# EAGLE design T02_noclock_rev1 (EAGLE 7.1.0)
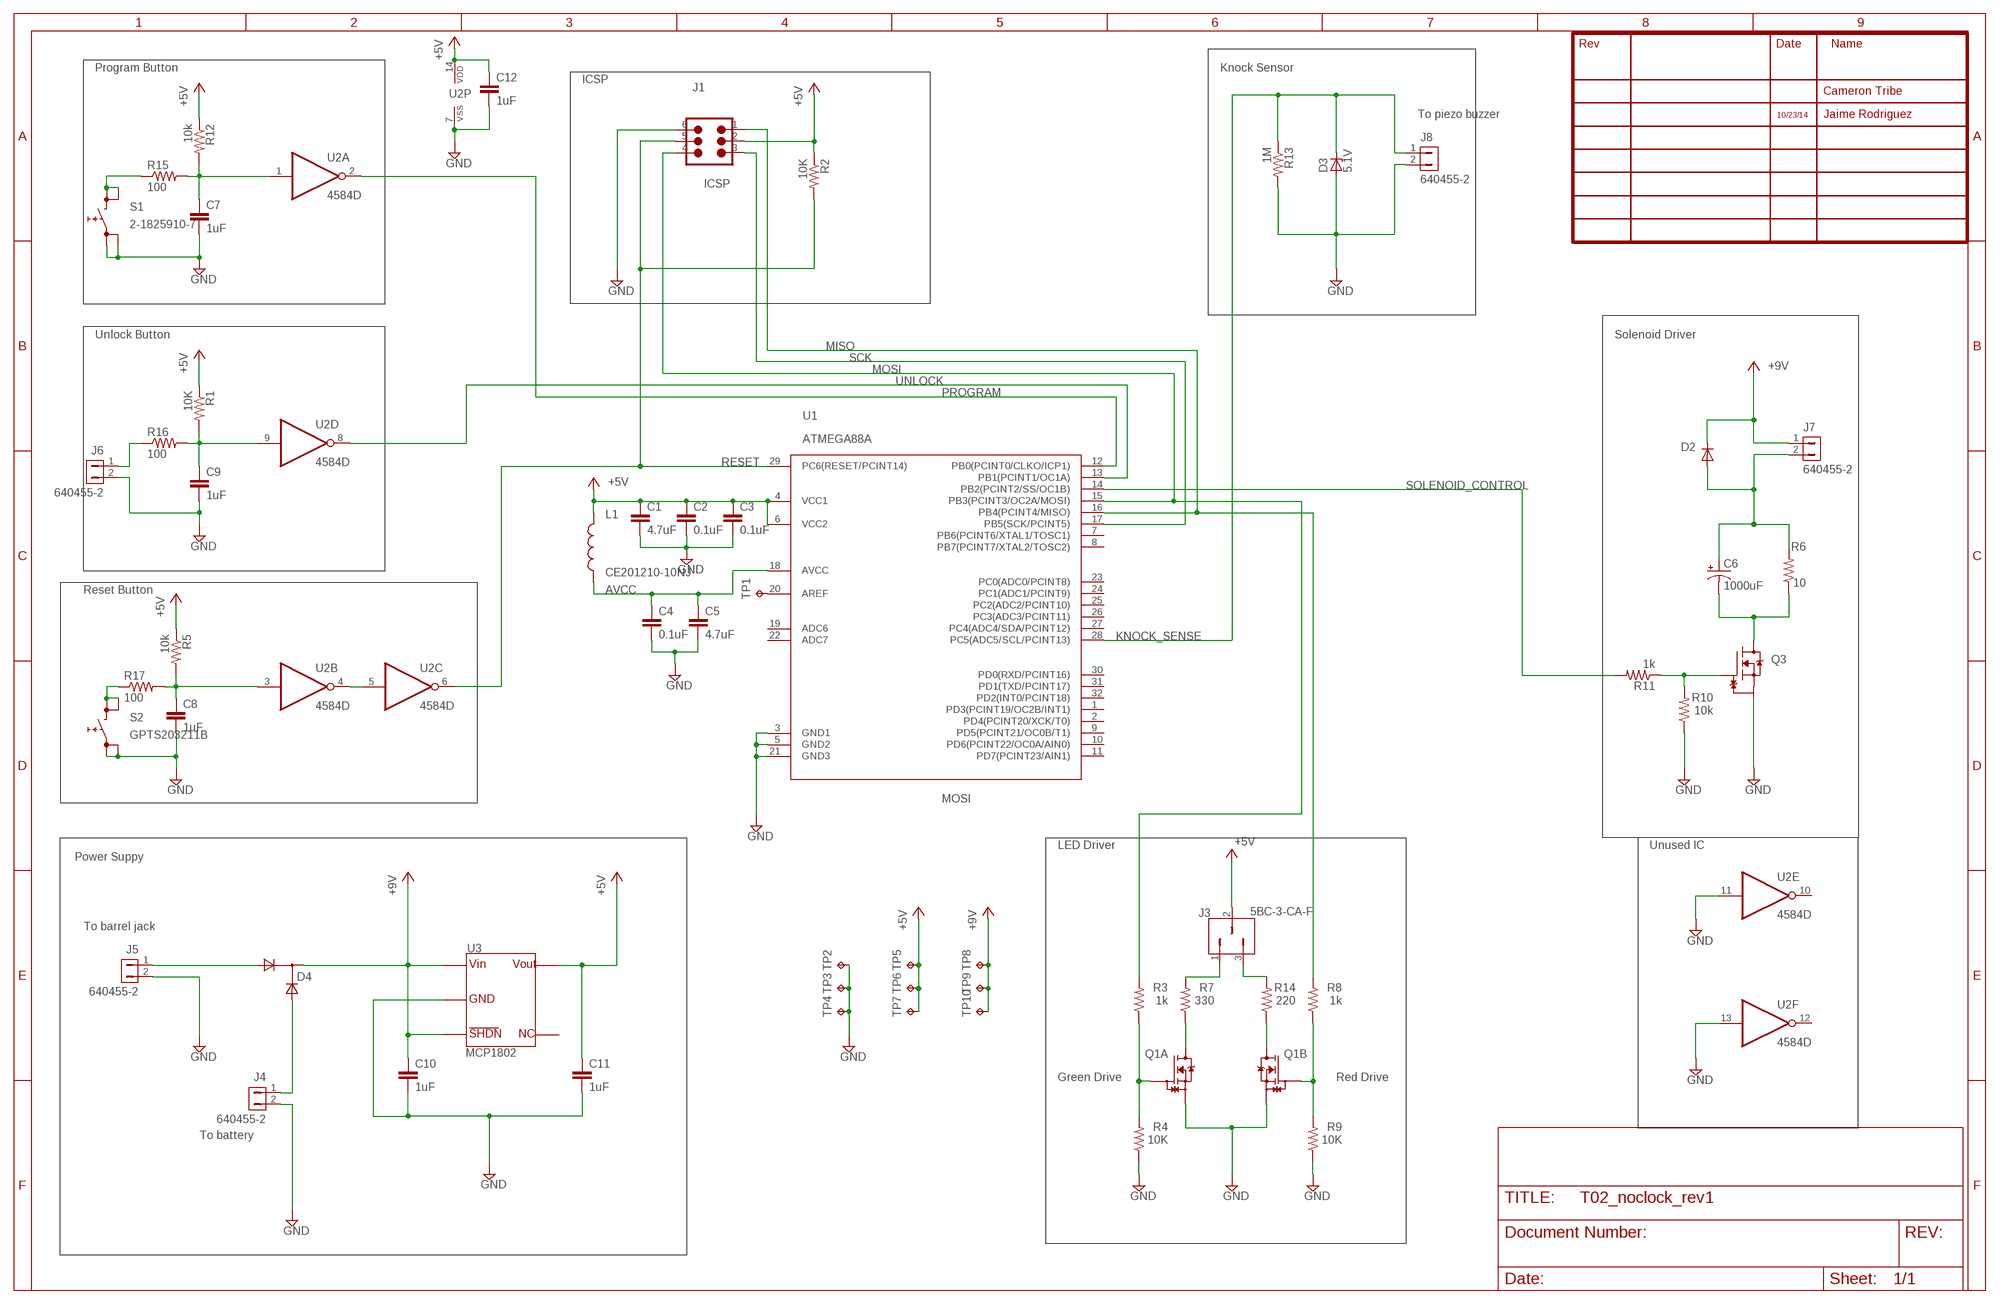
[diagram p0: schematic, sheet 1]

## Parts
C1  4.7uF  C-EUC0805  [C0805]
C2  0.1uF  C-EUC0805  [C0805]
C3  0.1uF  C-EUC0805  [C0805]
C4  0.1uF  C-EUC0805  [C0805]
C5  4.7uF  C-EUC0805  [C0805]
C6  1000uF  EKY-100ELL102MH20D  [EKY-100ELL102MH20D]
C7  1uF  C-EUC0805  [C0805]
C8  1uF  C-EUC0805  [C0805]
C9  1uF  C-EUC0805  [C0805]
C10  1uF  C-EUC0805  [C0805]
C11  1uF  C-EUC0805  [C0805]
C12  1uF  C-EUC0805  [C0805]
D2  GF1  [SMA-DO214AC]
D3  5.1V  ZENER-DIODESOT23  [SOT23]
D4  PMEG2005CT,215  [SOT-23]
J1  ICSP  [ICSP]
J3  5BC-3-CA-F  [3_PIN_CONNECTOR]
J4  640455-2  [2-PIN_CONNECTOR]
J5  640455-2  [2-PIN_CONNECTOR]
J6  640455-2  [2-PIN_CONNECTOR]
J7  640455-2  [2-PIN_CONNECTOR]
J8  640455-2  [2-PIN_CONNECTOR]
L1  CE201210-10NJ  [R0805]
Q1  DMN63D8LDW-7  [SOT363]
Q3  DMG1012UW-7  [SOT323]
R1  10K  R-US_R0805  [R0805]
R2  10K  R-US_R0805  [R0805]
R3  1k  R-US_R0805  [R0805]
R4  10K  R-US_R0805  [R0805]
R5  10k  R-US_R0805  [R0805]
R6  10  R-US_R2512  [R2512]
R7  330  R-US_R0805  [R0805]
R8  1k  R-US_R0805  [R0805]
R9  10K  R-US_R0805  [R0805]
R10  10k  R-US_R0805  [R0805]
R11  1k  R-US_R0805  [R0805]
R12  10k  R-US_R0805  [R0805]
R13  1M  R-US_R0805  [R0805]
R14  220  R-US_R0805  [R0805]
R15  100  R-US_R0805  [R0805]
R16  100  R-US_R0805  [R0805]
R17  100  R-US_R0805  [R0805]
S1  2-1825910-7  [FSM14JH]
S2  GPTS203211B  [GPTS203211B]
TP1  TPTP19R  [TP19R]
TP2  TPTP19R  [TP19R]
TP3  TPTP19R  [TP19R]
TP4  TPTP19R  [TP19R]
TP5  TPTP19R  [TP19R]
TP6  TPTP19R  [TP19R]
TP7  TPTP19R  [TP19R]
TP8  TPTP19R  [TP19R]
TP9  TPTP19R  [TP19R]
TP10  TPTP19R  [TP19R]
U1  ATMEGA88A  [TQFP32]
U2  4584D  [SO14]
U3  MCP1802  [SOT23-5]

## Nets
9V: D4.3(A1) J5.1
+5V: C1.1 C2.1 C3.1 C11.1 C12.1 J1.2 J3.2 L1.2 R1.1 R2.1 R5.1 R12.1 TP5.TP TP6.TP TP7.TP U1.4(VCC1) U1.6(VCC2) U2.14(P:VDD) U3.5(VOUT)
+9V: C10.1 D2.K(C) D4.2(C) J7.1 TP8.TP TP9.TP TP10.TP U3.1(VIN) U3.3(SHDN)
AVCC: C4.1 C5.1 L1.1 U1.18(AVCC)
BATT: D4.1(A2) J4.1
GND: C1.2 C2.2 C3.2 C4.2 C5.2 C7.2 C8.2 C9.2 C10.2 C11.2 C12.2 D3.1(A) J1.6 J4.2 J5.2 J6.2 J8.2 Q1.S1(A:S) Q1.S2(B:S) Q3.3(S) R4.1 R9.1 R10.1 R13.2 S1.1 S1.2 S2.1 S2.2 TP2.TP TP3.TP TP4.TP U1.3(GND1) U1.5(GND2) U1.21(GND3) U2.7(P:VSS) U2.11(E:I) U2.13(F:I) U3.2(GND)
KNOCK_SENSE: D3.3(C) J8.1 R13.1 U1.28(PC5(ADC5/SCL/PCINT13))
MISO: J1.1 R8.2 U1.16(PB4(PCINT4/MISO))
MOSI: J1.4 R3.2 U1.15(PB3(PCINT3/OC2A/MOSI))
N$1: Q1.D1(A:D) R7.1
N$2: Q1.G2(B:G) R8.1 R9.2
N$3: C9.1 R1.2 R16.2 U2.9(D:I)
N$5: J3.1 R7.2
N$6: J3.3 R14.2
N$7: R15.1 S1.3 S1.4
N$8: Q1.D2(B:D) R14.1
N$9: Q3.2(G) R10.2 R11.1
N$10: C6.+ D2.A J7.2 R6.2
N$11: C6.- Q3.1(D) R6.1
N$12: U2.4(B:O) U2.5(C:I)
N$13: TP1.TP U1.20(AREF)
N$14: R17.1 S2.3 S2.4
N$16: C8.1 R5.2 R17.2 U2.3(B:I)
N$17: J6.1 R16.1
N$19: C7.1 R12.2 R15.2 U2.1(A:I)
N$21: Q1.G1(A:G) R3.1 R4.2
PROGRAM: U1.12(PB0(PCINT0/CLKO/ICP1)) U2.2(A:O)
RESET: J1.5 R2.2 U1.29(PC6(RESET/PCINT14)) U2.6(C:O)
SCK: J1.3 U1.17(PB5(SCK/PCINT5))
SOLENOID_CONTROL: R11.2 U1.14(PB2(PCINT2/SS/OC1B))
UNLOCK: U1.13(PB1(PCINT1/OC1A)) U2.8(D:O)
Unconnected: U1.1(PD3(PCINT19/OC2B/INT1)) U1.2(PD4(PCINT20/XCK/T0)) U1.7(PB6(PCINT6/XTAL1/TOSC1)) U1.8(PB7(PCINT7/XTAL2/TOSC2)) U1.9(PD5(PCINT21/OC0B/T1)) U1.10(PD6(PCINT22/OC0A/AIN0)) U1.11(PD7(PCINT23/AIN1)) U1.19(ADC6) U1.22(ADC7) U1.23(PC0(ADC0/PCINT8)) U1.24(PC1(ADC1/PCINT9)) U1.25(PC2(ADC2/PCINT10)) U1.26(PC3(ADC3/PCINT11)) U1.27(PC4(ADC4/SDA/PCINT12)) U1.30(PD0(RXD/PCINT16)) U1.31(PD1(TXD/PCINT17)) U1.32(PD2(INT0/PCINT18)) U2.10(E:O) U2.12(F:O) U3.4(NC)

## Notes on the sheet
- Program Button | Knock Sensor
- ICSP
- Cameron Tribe
- To piezo buzzer | 10/23/14 | Jaime Rodriguez
- Unlock Button | Solenoid Driver
- Reset Button
- LED Driver | Unused IC
- Power Suppy
- To barrel jack
- Green Drive | Red Drive
- To battery

## Library data of the parts
C1 C5 = rcl:C-EU: CAPACITOR, European symbol; PARTNUM: CL21A475KOFNNNE
C2-C4 = rcl:C-EU: CAPACITOR, European symbol; PARTNUM: GRM155R61A104KA01D
C6 = nocLock_temp:EKY-100ELL102MH20D: CAP ALUM 1000UF 10V 20% RADIAL
C7-C12 = rcl:C-EU: CAPACITOR, European symbol; PARTNUM: CL21B105KBFNNNE
D2 = diode:GF1: DIODE; PARTNUM: S1J
D3 = diode:ZENER-DIODE: Z-Diode; PARTNUM: BZX84C4V7-TP
D4 = nocLock_temp:PMEG2005CT,215; PARTNUM: PMEG2005CT,215
J1 = nocLock_temp:ICSP: Programming ICSP Header
J3 = nocLock_temp_Rev2:5BC-3-CA-F: Connector Recept, 3-Pin; PARTNUM: 5BC-3-CA-F
J4-J8 = nocLock_temp_Rev2:640455-2: 2 Pin Rectangular Connector; PARTNUM: 640455-2
L1 = nocLock_temp:CE201210-10NJ: FIXED IND 10NH 300MA 300 MOHM
Q1 = nocLock_temp_Rev2:DMN63D8LDW-7: Dual MOSFET 2N-CH 30V 220MA SOT363; PARTNUM: DMN63D8LDW-7
Q3 = nocLock_temp:DMG1012UW-7: MOSFET N-CH 20V 1A SOT323 (For Solenoid); PARTNUM: DMG1012UW-7
R1 R2 R4 R5 R9 R10 R12 R15-R17 = rcl:R-US_: RESISTOR, American symbol; PARTNUM: ESR10EZPJ103
R3 R8 R11 = rcl:R-US_: RESISTOR, American symbol; PARTNUM: MCR10ERTF1001
R6 = rcl:R-US_: RESISTOR, American symbol; PARTNUM: CRM2512-JW-100ELF
R7 = rcl:R-US_: RESISTOR, American symbol; PARTNUM: MCR10ERTF3300
R13 = rcl:R-US_: RESISTOR, American symbol; PARTNUM: RMCF0805JT1M00
R14 = rcl:R-US_: RESISTOR, American symbol; PARTNUM: RMCF0805FT220R
S1 = nocLock_temp:2-1825910-7: SWITCH TACTILE SPST-NO 0.05A 12V Outline 6.00mm x 6.00mm Height 13mm
S2 = nocLock_temp:GPTS203211B: SWITCH PUSHBUTTON SPST 1A 30V OutLine 12x12mm Height 9.1mm
TP1-TP10 = testpad:TP: Test pad
U1 = nocLock_temp:ATMEGA88A: ATMega88A 8-Bit Microcontroller 23 GPIO pins RISC Architecture Up to 20 MHz; PARTNUM: ATMEGA88A-AUR
U2 = 45xx:4584: Hex SCHMITT TRIGGER (74C14); PARTNUM: 4584D
U3 = nocLock_temp:MCP1802: 5V Voltage Regulator MCP1802 Input Voltage Range: 2.0- 10.0 V Output Voltage 5V Current Max: 300 mA 25 uA Quiescent Current; PARTNUM: MCP1802

## Board
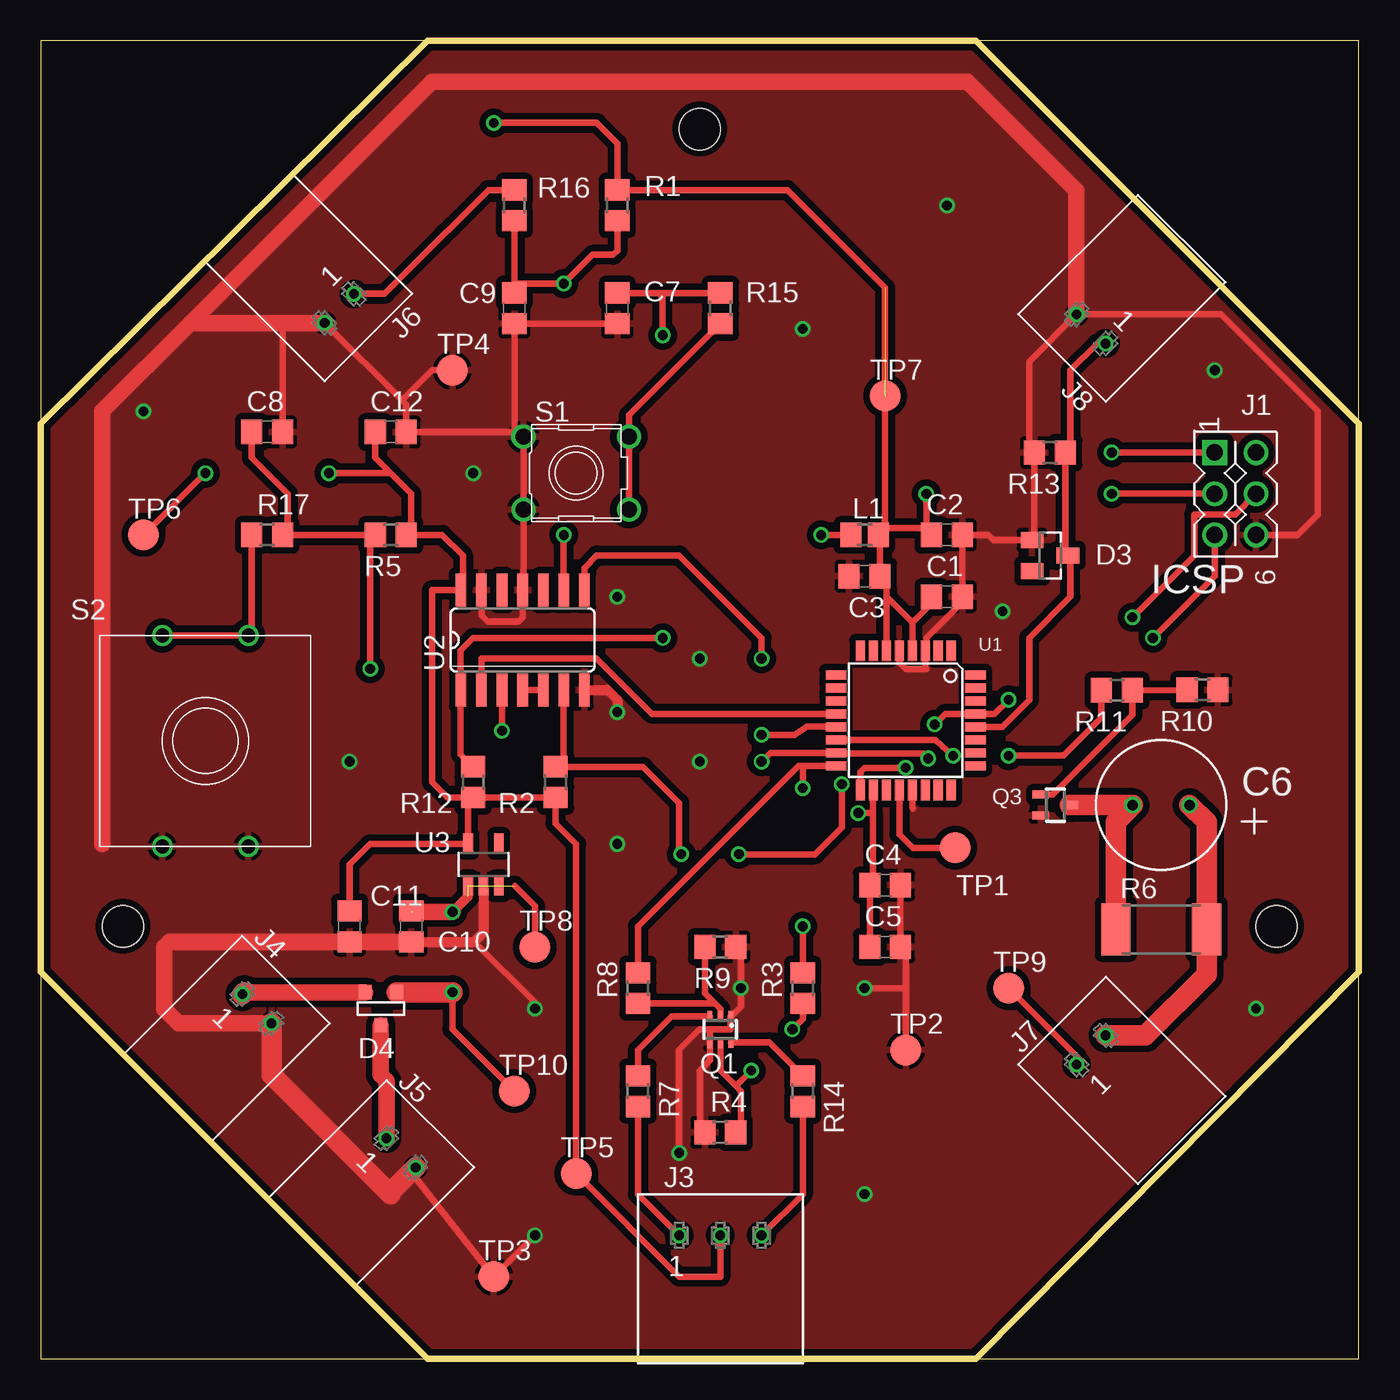
[diagram p1: board, top side]
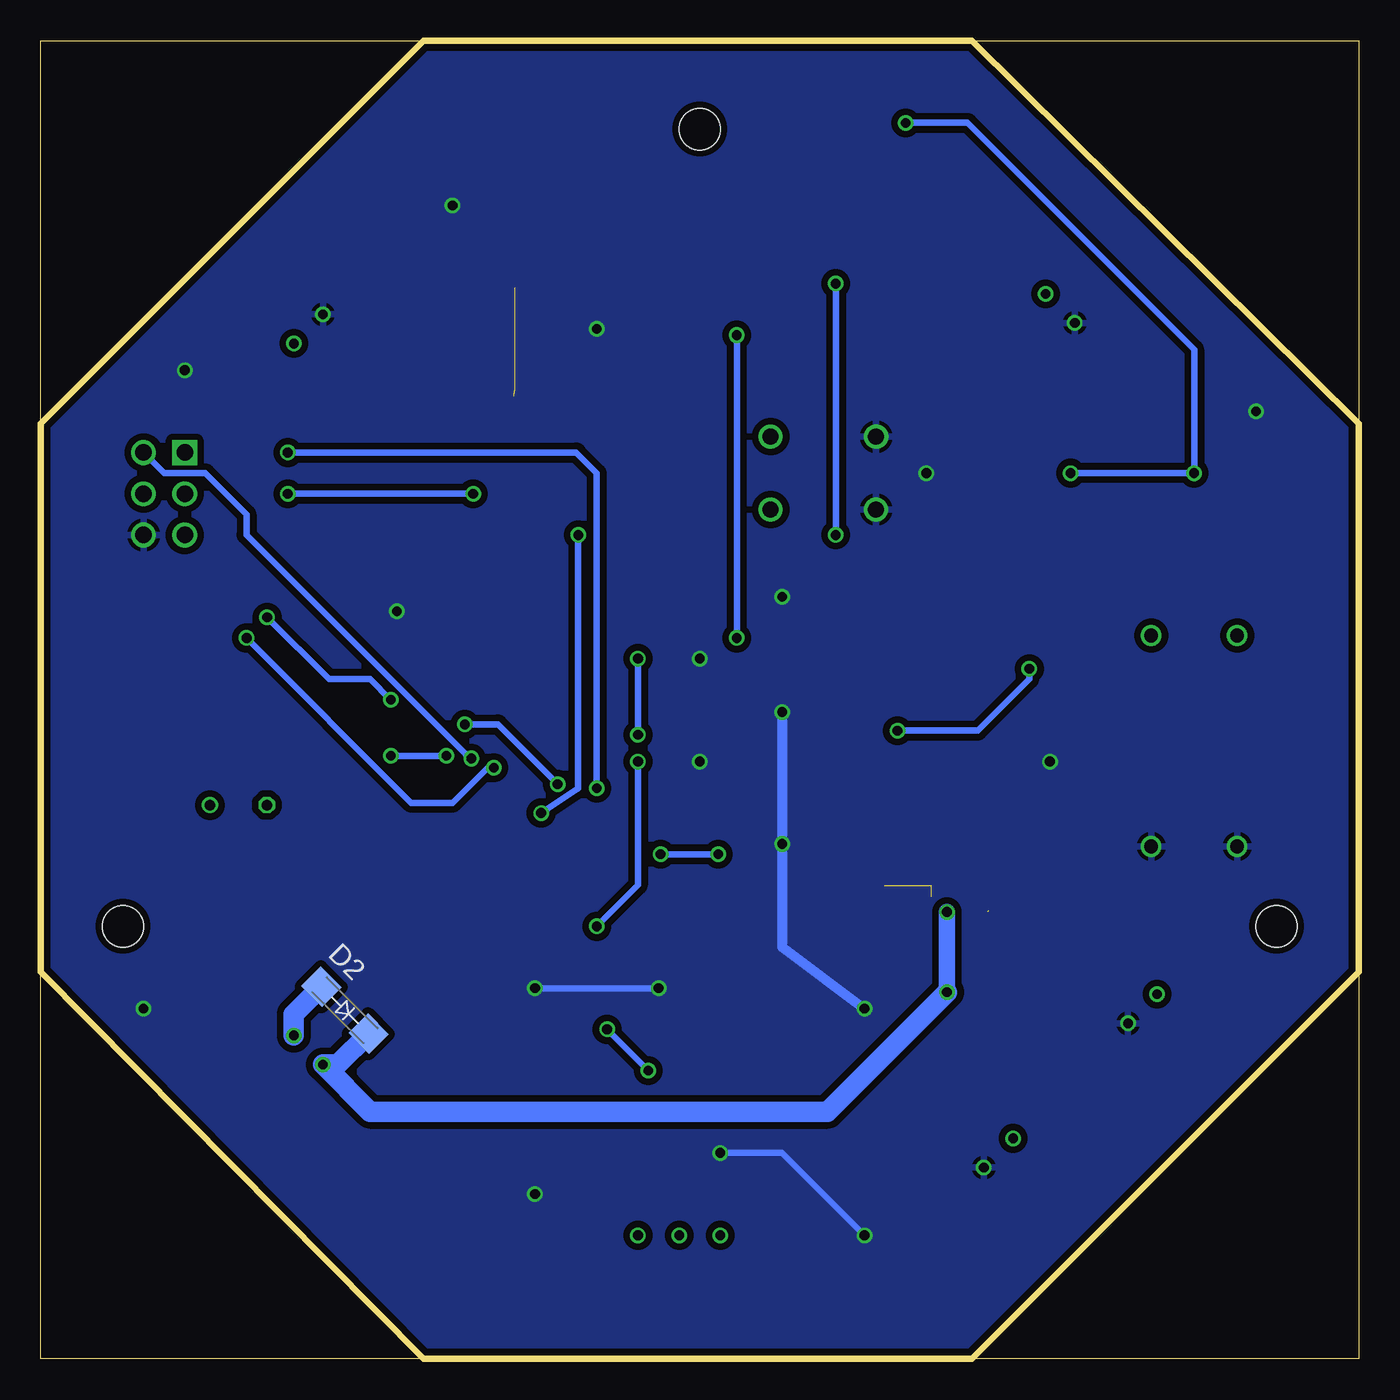
[diagram p2: board, bottom side, seen from below]

Size 81.28 x 81.28 mm. Coordinates in mm from the lower left corner, seen from the top.
Outline: 23.88,0 0,0 0,23.88
Outline: 57.66,0 81.28,0 81.28,23.88
Outline: 81.28,57.66 81.28,81.28 57.66,81.28
Outline: 23.88,81.28 0,81.28 0,57.66
Outline: 0,23.88 0,57.66
Outline: 0,23.88 23.88,0
Outline: 57.66,81.28 23.88,81.28
Outline: 23.88,0 57.66,0
Outline: 81.28,23.88 81.28,57.66
Outline: 81.28,23.88 57.66,0
Outline: 81.28,57.66 57.66,81.28
Outline: 23.88,81.28 0,57.66
Copper layers (1*16): Top 0.0356mm / dielectric 1.5011mm / Bottom 0.0356mm
Design rules "OSH-Park-2-layer": minimum track width 6mil, minimum drill 13mil, track to track 6mil, track to pad 6mil, pad to pad 6mil, via to via 6mil, smd to smd 6mil, copper to edge 15mil, drill to drill 6mil, minimum pad ring 7mil, minimum via ring 7mil, stop-mask expansion 3mil, vias tented up to drill 0mil, thermal gap 10mil
Holes 2.54 mm at 76.2,26.67 5.08,26.67 40.64,75.82

### Footprints (pad centres in the part's own frame; a part is rotated, then mirrored left to right if it is on the bottom)
C0805 = smd 1.3 x 1.5: 1 -0.95,0; 2 0.95,0
EKY-100ELL102MH20D = drill 0.65: + -1.75,0 | drill 0.65 octagon: - 1.75,0
SMA-DO214AC = smd 1.8 x 1.7: A -2.05,0; K 2.05,0
SOT23 = smd 1 x 1.4: 1 -0.95,-1.1; 2 0.95,-1.1; 3 0,1.1
SOT-23 = smd 0.787 x 0.889: 1 -0.94,1.016; 2 0.991,1.016; 3 0.025,-1.016
ICSP = drill 1.016 square: 1 -5.08,1.27 | drill 1.016: 2 -2.54,1.27; 3 0,1.27; 4 -5.08,3.81; 5 -2.54,3.81; 6 0,3.81
3_PIN_CONNECTOR = drill 0.6: 1 -2.54,0; 2 0,0; 3 2.54,0
2-PIN_CONNECTOR = drill 0.6: 1 -1.27,0; 2 1.27,0
R0805 = smd 1.3 x 1.5: 1 -0.85,0; 2 0.85,0
SOT363 = smd 0.3 x 0.7: D1 -0.62,-0.8; D2 -1.92,0.8; G1 -1.27,0.8; G2 -1.27,-0.8; S1 -0.62,0.8; S2 -1.92,-0.8
SOT323 = smd 0.5 x 1: 1 0,0.9; 2 -0.65,-0.9; 3 0.65,-0.9
R0805' = smd 1.3 x 1.5: 1 -0.95,0; 2 0.95,0
R2512 = smd 1.8 x 3.2: 1 -2.8,0; 2 2.8,0
FSM14JH = drill 1: 1 -3.25,2.25 | drill 0.99: 2 -3.25,-2.25; 3 3.25,2.25; 4 3.25,-2.25
GPTS203211B = drill 0.85: 1 -6.5,2.65; 2 -6.5,-2.65; 3 6.5,2.65; 4 6.5,-2.65
TP19R = smd 1.9 x 1.9: TP 0,0
TQFP32 = smd 1.27 x 0.559: 1 -4.293,2.8; 2 -4.293,2; 3 -4.293,1.2; 4 -4.293,0.4; 5 -4.293,-0.4; 6 -4.293,-1.2; 7 -4.293,-2; 8 -4.293,-2.8; 17 4.293,-2.8; 18 4.293,-2; 19 4.293,-1.2; 20 4.293,-0.4; 21 4.293,0.4; 22 4.293,1.2; 23 4.293,2; 24 4.293,2.8 | smd 0.559 x 1.27: 9 -2.8,-4.293; 10 -2,-4.293; 11 -1.2,-4.293; 12 -0.4,-4.293; 13 0.4,-4.293; 14 1.2,-4.293; 15 2,-4.293; 16 2.8,-4.293; 25 2.8,4.293; 26 2,4.293; 27 1.2,4.293; 28 0.4,4.293; 29 -0.4,4.293; 30 -1.2,4.293; 31 -2,4.293; 32 -2.8,4.293
SO14 = smd 0.66 x 2.032: 1 -3.81,-3.073; 2 -2.54,-3.073; 3 -1.27,-3.073; 4 0,-3.073; 5 1.27,-3.073; 6 2.54,-3.073; 7 3.81,-3.073; 8 3.81,3.073; 9 2.54,3.073; 10 1.27,3.073; 11 0,3.073; 12 -1.27,3.073; 13 -2.54,3.073; 14 -3.81,3.073
SOT23-5 = smd 0.6 x 1.2: 1 -0.95,-1.306; 2 0,-1.306; 3 0.95,-1.306; 4 0.95,1.306; 5 -0.95,1.306

### Placement (x,y rotation side)
C1  55.88,46.99 0 top
C2  55.88,50.8 0 top
C3  50.8,48.26 180 top
C4  52.07,29.21 0 top
C5  52.07,25.4 0 top
C6  69.08,34.15 180 top
C7  35.56,64.77 270 top
C8  13.97,57.15 0 top
C9  29.21,64.77 270 top
C10  22.86,26.67 270 top
C11  19.05,26.67 270 top
C12  21.59,57.15 0 top
D2  62.51,21.5 315 bottom
D3  62.23,49.53 270 top
D4  20.95,21.59 0 top
J1  71.12,50.8 270 top
J3  41.91,7.62 0 top
J4  13.34,21.59 315 top
J5  22.23,12.7 315 top
J6  18.41,64.77 225 top
J7  64.77,19.05 45 top
J8  64.77,63.5 135 top
L1  50.8,50.8 0 top
Q1  40.64,20.32 180 top
Q3  62.56,34.15 270 top
R1  10K  [R0805']  35.56,71.12 270 top
R2  10K  [R0805']  31.75,35.56 90 top
R3  1k  [R0805']  46.99,22.86 90 top
R4  10K  [R0805']  41.91,13.97 0 top
R5  10k  [R0805']  21.59,50.8 180 top
R6  69.09,26.49 0 top
R7  330  [R0805']  36.83,16.51 270 top
R8  1k  [R0805']  36.83,22.86 90 top
R9  10K  [R0805']  41.91,25.4 180 top
R10  10k  [R0805']  71.64,41.25 180 top
R11  1k  [R0805']  66.36,41.22 180 top
R12  10k  [R0805']  26.67,35.56 90 top
R13  1M  [R0805']  62.23,55.88 180 top
R14  220  [R0805']  46.99,16.51 270 top
R15  100  [R0805']  41.91,64.77 90 top
R16  100  [R0805']  29.21,71.12 270 top
R17  100  [R0805']  13.97,50.8 0 top
S1  33.02,54.61 0 top
S2  10.16,38.1 90 top
TP1  56.39,31.52 0 top
TP2  53.34,19.05 0 top
TP3  27.94,5.08 0 top
TP4  25.4,60.96 0 top
TP5  33.02,11.43 0 top
TP6  6.35,50.8 0 top
TP7  52.07,59.36 0 top
TP8  30.48,25.4 0 top
TP9  59.69,22.86 0 top
TP10  29.21,16.51 0 top
U1  53.34,39.37 270 top
U2  29.72,44.32 0 top
U3  27.3,30.48 0 top

### Tracks (layer width: path | path; a pad name or v marks a point on that pad's centre or on a via)
9V
  Top 1.016: J5.1 21.33,17.15 20.95,17.53 20.95,20.55 D4.3
+5V  (via drill 0.6)  (2 unrouted)
  Top 0.406: C3.1 51.75,50.8 L1.2 52.07,51.22 | C3.1 52.07,48.26 | C12.1 20.64,55.56 21.59,54.61 | 21.59,54.61 22.86,53.34 22.86,51.12 R5.1 24.77,50.8 26.04,49.53 26.04,47.52 U2.14 24.13,47.4 24.13,35.56 25.08,34.61 R12.1 | R12.1 R2.1 31.75,33.02 33.02,31.75 TP5.TP 39.37,5.08 41.91,5.08 J3.2 | 52.07,51.22 52.07,66.04 46.04,72.07 R1.1 35.56,74.93 34.29,76.2 v27.94,76.2 | J1.2 v66.04,53.34 | v54.61,53.34 54.61,51.12 C2.1 54.51,51.22 52.07,51.22 | TP6.TP v10.16,54.61 | v17.78,54.61 21.59,54.61 | R12.1 26.36,34.3 U3.5 26.32,31.75 20.32,31.75 19.05,30.48 C11.1 | U1.6 52.14,46.99 | 52.14,46.99 52.14,47.87 C3.1 | U1.4 53.74,45.39 | 53.74,45.39 52.14,46.99 | C1.1 54.93,46.58 53.74,45.39
  Bottom 0.406: v66.04,53.34 v54.61,53.34 | v17.78,54.61 v10.16,54.61 10.16,62.23 24.13,76.2 v27.94,76.2
+9V  (via drill 0.6)  (4 unrouted)
  Top 0.406: 29.25,29.17 30.48,27.94 TP8.TP | v25.4,22.61 25.4,20.32 TP10.TP | TP9.TP 63.87,18.68 J7.1
  Top 0.61: 26.36,28.51 v25.4,27.56
  Top 1.016: v25.4,27.56 22.92,27.56
  Top 1.27: D4.2 v25.4,22.61
  Bottom 1.016: v25.4,22.61 v25.4,27.56
  Bottom 1.27: v25.4,22.61 32.77,15.24 60.96,15.24 J7.1 62.97,18.15 D2.K
AVCC  (via drill 0.6)
  Top 0.406: C5.1 C4.1 | 51.31,34.98 U1.18 51.31,35.05 51.31,33.66 | 51.44,29.52 C4.1 | L1.1 v48.13,50.8 | v50.42,33.66 51.31,33.66 | 51.31,33.66 51.31,29.4 C4.1
  Bottom 0.406: v48.13,50.8 48.13,35.18 v50.42,33.66
BATT
  Top 1.016: 12.55,22.61 D4.1
  Top 1.27: 12.55,22.61 J4.1
GND  (via drill 0.6)
  Top 0.406: U1.5 52.94,42.95 53.34,42.55 54.61,42.55 54.54,42.62 U1.3 54.61,43.73 54.61,44.45 56.83,46.67 C1.2 C2.2 58.42,50.8 58.74,50.48 D3.1 61.28,50.63 R13.2 | 61.59,56.2 R13.2 | R4.1 40.64,14.29 40.64,17.78 41.26,18.4 Q1.S1 41.26,20.3 | 41.26,20.3 41.27,20.32 42.55,20.32 42.55,21.11 Q1.S2 42.86,21.42 42.88,21.42 43.18,21.72 v43.18,22.86 43.18,25.08 R9.1 | 22.28,59.11 22.54,58.85 C12.2 29.21,57.15 | 22.28,59.11 J6.2 | 29.21,57.15 29.48,57.15 S1.1 S1.2 29.77,47.45 U2.11 29.72,45.72 29.46,45.47 27.56,45.47 27.18,45.85 U2.13 | 29.21,57.15 C9.2 C7.2 | C4.2 C5.2 53.34,25.08 53.34,22.86 | 12.7,31.71 S2.2 | R13.2 60.96,56.2 60.96,61.49 J8.2 72.76,64.4 78.74,58.42 78.74,52.07 77.47,50.8 J1.6 | TP4.TP 24.13,60.96 22.28,59.11 | J5.2 23.12,11.17 TP3.TP v30.48,7.62 | 53.34,22.86 TP2.TP | v50.8,22.86 53.34,22.86 | 41.26,20.3 40.62,20.3 39.37,19.05 v39.37,12.7 | C8.2 14.92,63.55 15.24,63.87 | v30.48,21.59 30.48,21.98 26.74,25.72 | U1.21 53.74,34 53.79,33.95
  Top 0.61: C10.2 26.74,25.72 27.3,26.29 U3.2 | U2.7 34.95,41.25 35.56,40.64 v35.56,39.88
  Top 1.016: J4.2 8.52,20.69 7.62,21.59 7.62,25.4 7.94,25.72 C11.2 C10.2 | 7.62,31.49 S2.1 | 3.81,31.75 3.81,58.42 9.26,63.87 | 9.26,63.87 24.13,78.74 57.15,78.74 63.87,72.02 J8.2 | J6.2 15.24,63.87 9.26,63.87
  Top 1.27: J4.2 14.23,17.52 21.59,10.16 21.59,10.27 J5.2
  Bottom 0.406: v43.18,22.86 v50.8,22.86 | v39.37,12.7 35.56,12.7 v30.48,7.62
  Bottom 0.61: v35.56,39.88 v35.56,31.75 35.56,25.4 v30.48,21.59
  other vias: 46.99,63.5 55.88,71.12 72.39,60.96 59.31,46.1 35.56,46.99 40.64,43.18 40.64,36.83 50.8,10.16 74.93,21.59 6.35,58.42 26.67,54.61 19.05,36.83
  pour Bottom (isolate 0.406): 0,24.13 0,57.53 23.88,81.28 57.53,81.28 81.15,57.66 81.28,24.13 57.53,0.13 23.88,0
  pour Top (isolate 0.406): 0,24.13 -0.13,57.66 23.75,81.15 57.53,81.28 81.15,57.66 81.28,23.75 57.66,0.25 23.75,0.13 -0.13,24
KNOCK_SENSE
  Top 0.406: J8.1 65.14,62.6 63.5,60.96 63.5,56.2 R13.1 63.18,49.68 D3.3 63.5,49.36 63.5,46.99 60.96,44.45 60.96,40.64 59.29,38.97 U1.28
MISO  (via drill 0.6)
  Top 0.406: U1.16 46.99,36.57 | 46.99,36.57 46.73,36.57 36.83,26.67 R8.2 | J1.1 v66.04,55.88 | v46.99,35.18 46.99,36.57
  Bottom 0.406: v66.04,55.88 48.26,55.88 46.99,54.61 v46.99,35.18
MOSI  (via drill 0.6)
  Top 0.406: v44.45,36.83 44.99,37.37 U1.15 49.08,37.34 54.4,37.34 v54.72,37.02 | v46.99,26.67 R3.2
  Bottom 0.406: J1.4 73.66,54.61 71.12,54.61 68.58,52.07 68.58,50.8 55.12,37.34 v54.72,37.02 | v44.45,36.83 44.45,29.21 v46.99,26.67
N$1
  Top 0.406: R7.1 36.83,19.05 38.9,21.12 Q1.D1
N$2
  Top 0.406: R8.1 41.59,21.91 | 41.59,21.91 41.91,21.59 Q1.G2 | R9.2 40.96,22.54 41.59,21.91
N$3  (via drill 0.6)
  Top 0.406: R16.2 29.21,66.04 | 32.38,47.52 U2.9 v32.26,50.8 | 29.21,66.04 29.46,66.29 v32.26,66.29 34.04,68.07 35.31,68.07 35.56,68.33 R1.2 | 29.21,66.04 C9.1
  Bottom 0.406: v32.26,66.29 v32.26,50.8
N$5
  Top 0.406: R7.2 36.83,10.16 J3.1
N$6
  Top 0.406: R14.2 46.99,10.16 J3.3
N$7
  Top 0.406: S1.4 S1.3 36.27,58.18 R15.1
N$8
  Top 0.406: Q1.D2 44.93,19.52 R14.1
N$9
  Top 0.406: R10.2 R11.1 67.31,39.71 62.4,34.8 Q3.2
N$10
  Top 1.27: J7.2 68.11,19.95 71.89,23.72 R6.2 71.89,33.1 C6.+
  Bottom 1.27: D2.A 65.67,21.25 J7.2
N$11
  Top 1.27: Q3.1 C6.- 66.29,33.11 R6.1
N$12
  Top 0.406: U2.4 U2.5
N$13
  Top 0.406: U1.20 52.94,32.35 53.77,31.51 TP1.TP
N$14
  Top 0.406: S2.3 S2.4 13.02,44.81 R17.1
N$16  (via drill 0.6)
  Top 0.406: C8.1 13.02,55.56 15.24,53.34 15.24,51.12 R17.2 R5.2 20.32,50.48 v20.32,42.55 | U2.3 v28.45,38.73
  Bottom 0.406: v28.45,38.73 23.5,38.73 20.32,41.91 v20.32,42.55
N$17
  Top 0.406: J6.1 21.22,65.67 24.77,69.22 25.4,69.85 27.62,72.07 R16.1
N$19  (via drill 0.6)
  Top 0.406: C7.1 38.1,65.72 | 38.1,65.72 R15.2 | v38.35,44.45 26.67,44.45 25.91,43.69 U2.1 25.91,37.27 R12.2 | v38.35,63.12 38.35,65.47 38.1,65.72
  Bottom 0.406: v38.35,44.45 v38.35,63.12
N$21  (via drill 0.6)
  Top 0.406: Q1.G1 41.91,17.78 42.86,16.83 | 42.86,16.83 43.18,16.51 43.18,14.29 R4.2 | R3.1 46.99,20.95 v46.35,20.32 | v43.81,17.78 42.86,16.83
  Bottom 0.406: v46.35,20.32 v43.81,17.78
PROGRAM
  Top 0.406: U1.12 37.7,39.77 34.29,43.18 27.18,43.18 U2.2
RESET  (via drill 0.6)
  Top 0.406: J1.5 73.66,52.07 71.12,52.07 71.12,49.53 v67.31,45.72 | v59.69,40.64 58.82,39.77 U1.29 55.77,39.77 v55.12,39.12 | v49.4,35.43 49.4,32.77 47.75,31.11 v43.05,31.11 | U2.6 32.26,37.02 R2.2 37.15,36.51 39.37,34.29 39.37,31.24 v39.5,31.11
  Bottom 0.406: v59.69,40.64 60.96,41.91 63.5,41.91 v67.31,45.72 | v55.12,39.12 53.09,39.12 v49.4,35.43 | v39.5,31.11 v43.05,31.11
SCK  (via drill 0.6)
  Top 0.406: J1.3 72.39,48.26 v68.58,44.45 | U1.17 50.54,36.19 50.8,36.45 v53.34,36.45
  Bottom 0.406: v68.58,44.45 58.42,34.29 55.88,34.29 53.72,36.45 v53.34,36.45
SOLENOID_CONTROL  (via drill 0.6)
  Top 0.406: U1.14 55.17,38.17 v56.26,37.18 | v59.68,37.19 63.06,37.19 65.41,39.55 R11.2
  Bottom 0.406: v56.26,37.18 v59.67,37.18 v59.68,37.19
UNLOCK  (via drill 0.6)
  Top 0.406: v44.45,38.48 46.48,38.48 47.24,38.99 49.03,38.99 U1.13 | v44.45,43.18 44.45,44.45 39.37,49.53 34.29,49.53 33.53,48.77 U2.8
  Bottom 0.406: v44.45,43.18 v44.45,38.48

### Text on the board
tPlace: ICSP